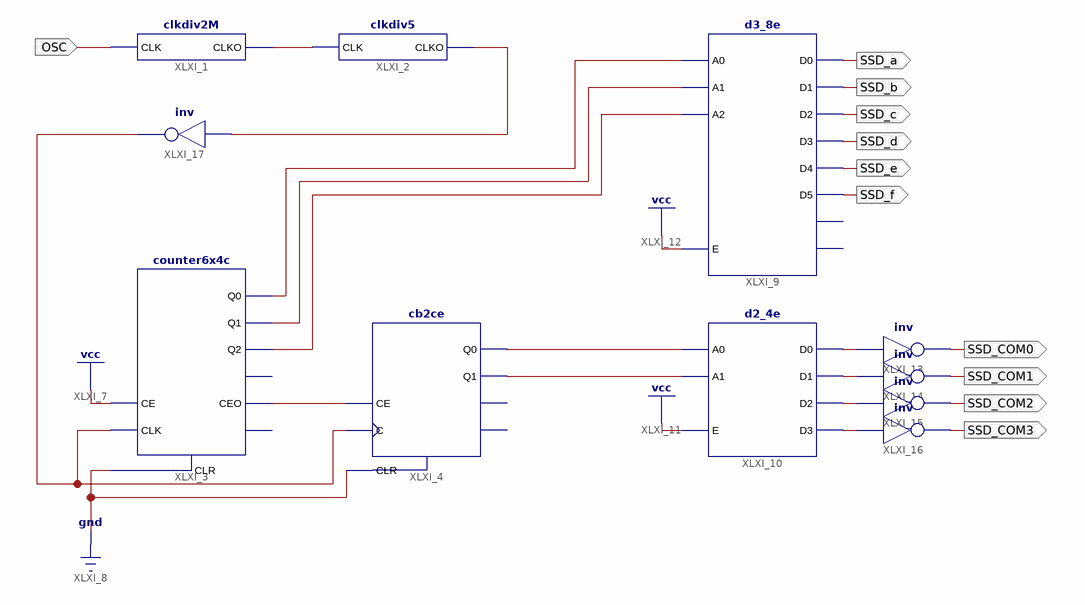
[diagram p0: schematic sheet 1]
// Xilinx ISE schematic main.sch (spartan6) as structural Verilog: 11 symbols, 11 ports
module main (
  input  OSC,
  output SSD_a,
  output SSD_b,
  output SSD_c,
  output SSD_d,
  output SSD_e,
  output SSD_f,
  output SSD_COM0,
  output SSD_COM1,
  output SSD_COM2,
  output SSD_COM3
);

  wire XLXN_3, XLXN_6, XLXN_11, XLXN_14, XLXN_15, XLXN_19, XLXN_22, XLXN_24, XLXN_35, XLXN_36, XLXN_37,
       XLXN_38, XLXN_43;

  counter6x4c XLXI_3 (
    .CE(1'b1), .CLK(XLXN_11), .CLR(1'b0), .CEO(XLXN_6), .Q0(XLXN_19), .Q1(XLXN_22), .Q2(XLXN_24));  // open: Q3, TC
  cb2ce XLXI_4 (.C(XLXN_11), .CE(XLXN_6), .CLR(1'b0), .Q0(XLXN_14), .Q1(XLXN_15));  // open: CEO, TC
  clkdiv2M XLXI_1 (.CLK(OSC), .CLKO(XLXN_3));
  clkdiv5 XLXI_2 (.CLK(XLXN_3), .CLKO(XLXN_43));
  d3_8e XLXI_9 (
    .A0(XLXN_19), .A1(XLXN_22), .A2(XLXN_24), .E(1'b1), .D0(SSD_a), .D1(SSD_b), .D2(SSD_c), .D3(SSD_d),
    .D4(SSD_e), .D5(SSD_f));  // open: D6, D7
  d2_4e XLXI_10 (.A0(XLXN_14), .A1(XLXN_15), .E(1'b1), .D0(XLXN_35), .D1(XLXN_36), .D2(XLXN_37), .D3(XLXN_38));
  not XLXI_13 (SSD_COM0, XLXN_35);
  not XLXI_14 (SSD_COM1, XLXN_36);
  not XLXI_15 (SSD_COM2, XLXN_37);
  not XLXI_16 (SSD_COM3, XLXN_38);
  not XLXI_17 (XLXN_11, XLXN_43);
endmodule
